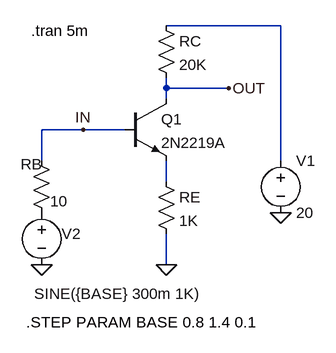
[diagram p0: schematic Fig_6-21_1_Tr_Amp_TRAN_step-B.asc]
Fig_6-21_1_Tr_Amp_TRAN_step-B.asc, the LTspice schematic file:
Version 4
SHEET 1 880 680
WIRE 304 64 128 64
WIRE 128 160 128 144
WIRE 224 160 128 160
WIRE 128 176 128 160
WIRE 0 224 -64 224
WIRE 64 224 0 224
WIRE -64 272 -64 224
WIRE 304 272 304 64
WIRE 128 304 128 272
WIRE 128 432 128 384
FLAG 128 432 0
FLAG -64 432 0
FLAG 304 352 0
FLAG 224 160 OUT
FLAG 0 224 IN
SYMBOL npn 64 176 R0
SYMATTR InstName Q1
SYMATTR Value 2N2219A
SYMBOL res 112 48 R0
SYMATTR InstName RC
SYMATTR Value 20K
SYMBOL res 112 288 R0
SYMATTR InstName RE
SYMATTR Value 1K
SYMBOL voltage 304 256 R0
WINDOW 123 0 0 Left 2
WINDOW 39 0 0 Left 2
SYMATTR InstName V1
SYMATTR Value 20
SYMBOL voltage -64 336 R0
WINDOW 123 25 102 Left 2
WINDOW 39 0 0 Left 2
WINDOW 0 31 48 Left 2
WINDOW 3 -11 140 Left 2
SYMATTR InstName V2
SYMATTR Value SINE({BASE} 300m 1K)
SYMBOL res -80 256 R0
WINDOW 0 -16 21 Left 2
WINDOW 3 29 78 Left 2
SYMATTR InstName RB
SYMATTR Value 10
TEXT -80 72 Left 2 !.tran 5m
TEXT -88 520 Left 2 !.STEP PARAM BASE 0.8 1.4 0.1

The netlist it stands for:
* Fig_6-21_1_Tr_Amp_TRAN_step-B.asc
Q1 OUT IN N002 0 2N2219A
RC N001 OUT 20K
RE N002 0 1K
V1 N001 0 20
V2 P001 0 SINE({BASE} 300m 1K)
RB IN P001 10
.model NPN NPN
.model PNP PNP
.lib standard.bjt
.tran 5m
.STEP PARAM BASE 0.8 1.4 0.1
.backanno
.end